# Altium schematic sheet Core CNC shield.SchDoc
size A2; PageSetup: Record=PageOptions|CenterHorizontal=True|CenterVertical=True|PrintScale=0.71|XCorrection=1.00|YCorrection=1.00|PrintKind=1|BorderSize=5000000|LeftOffset=0|BottomOffset=0|Orientation=2|PaperLength=1000|PaperWidth=1000|Scale=100|PaperSource=7|PrintQuality=-4|MediaType=1|DitherType=10|PaperKind=A3 (297 x 420 mm)|PrintScaleMode=1
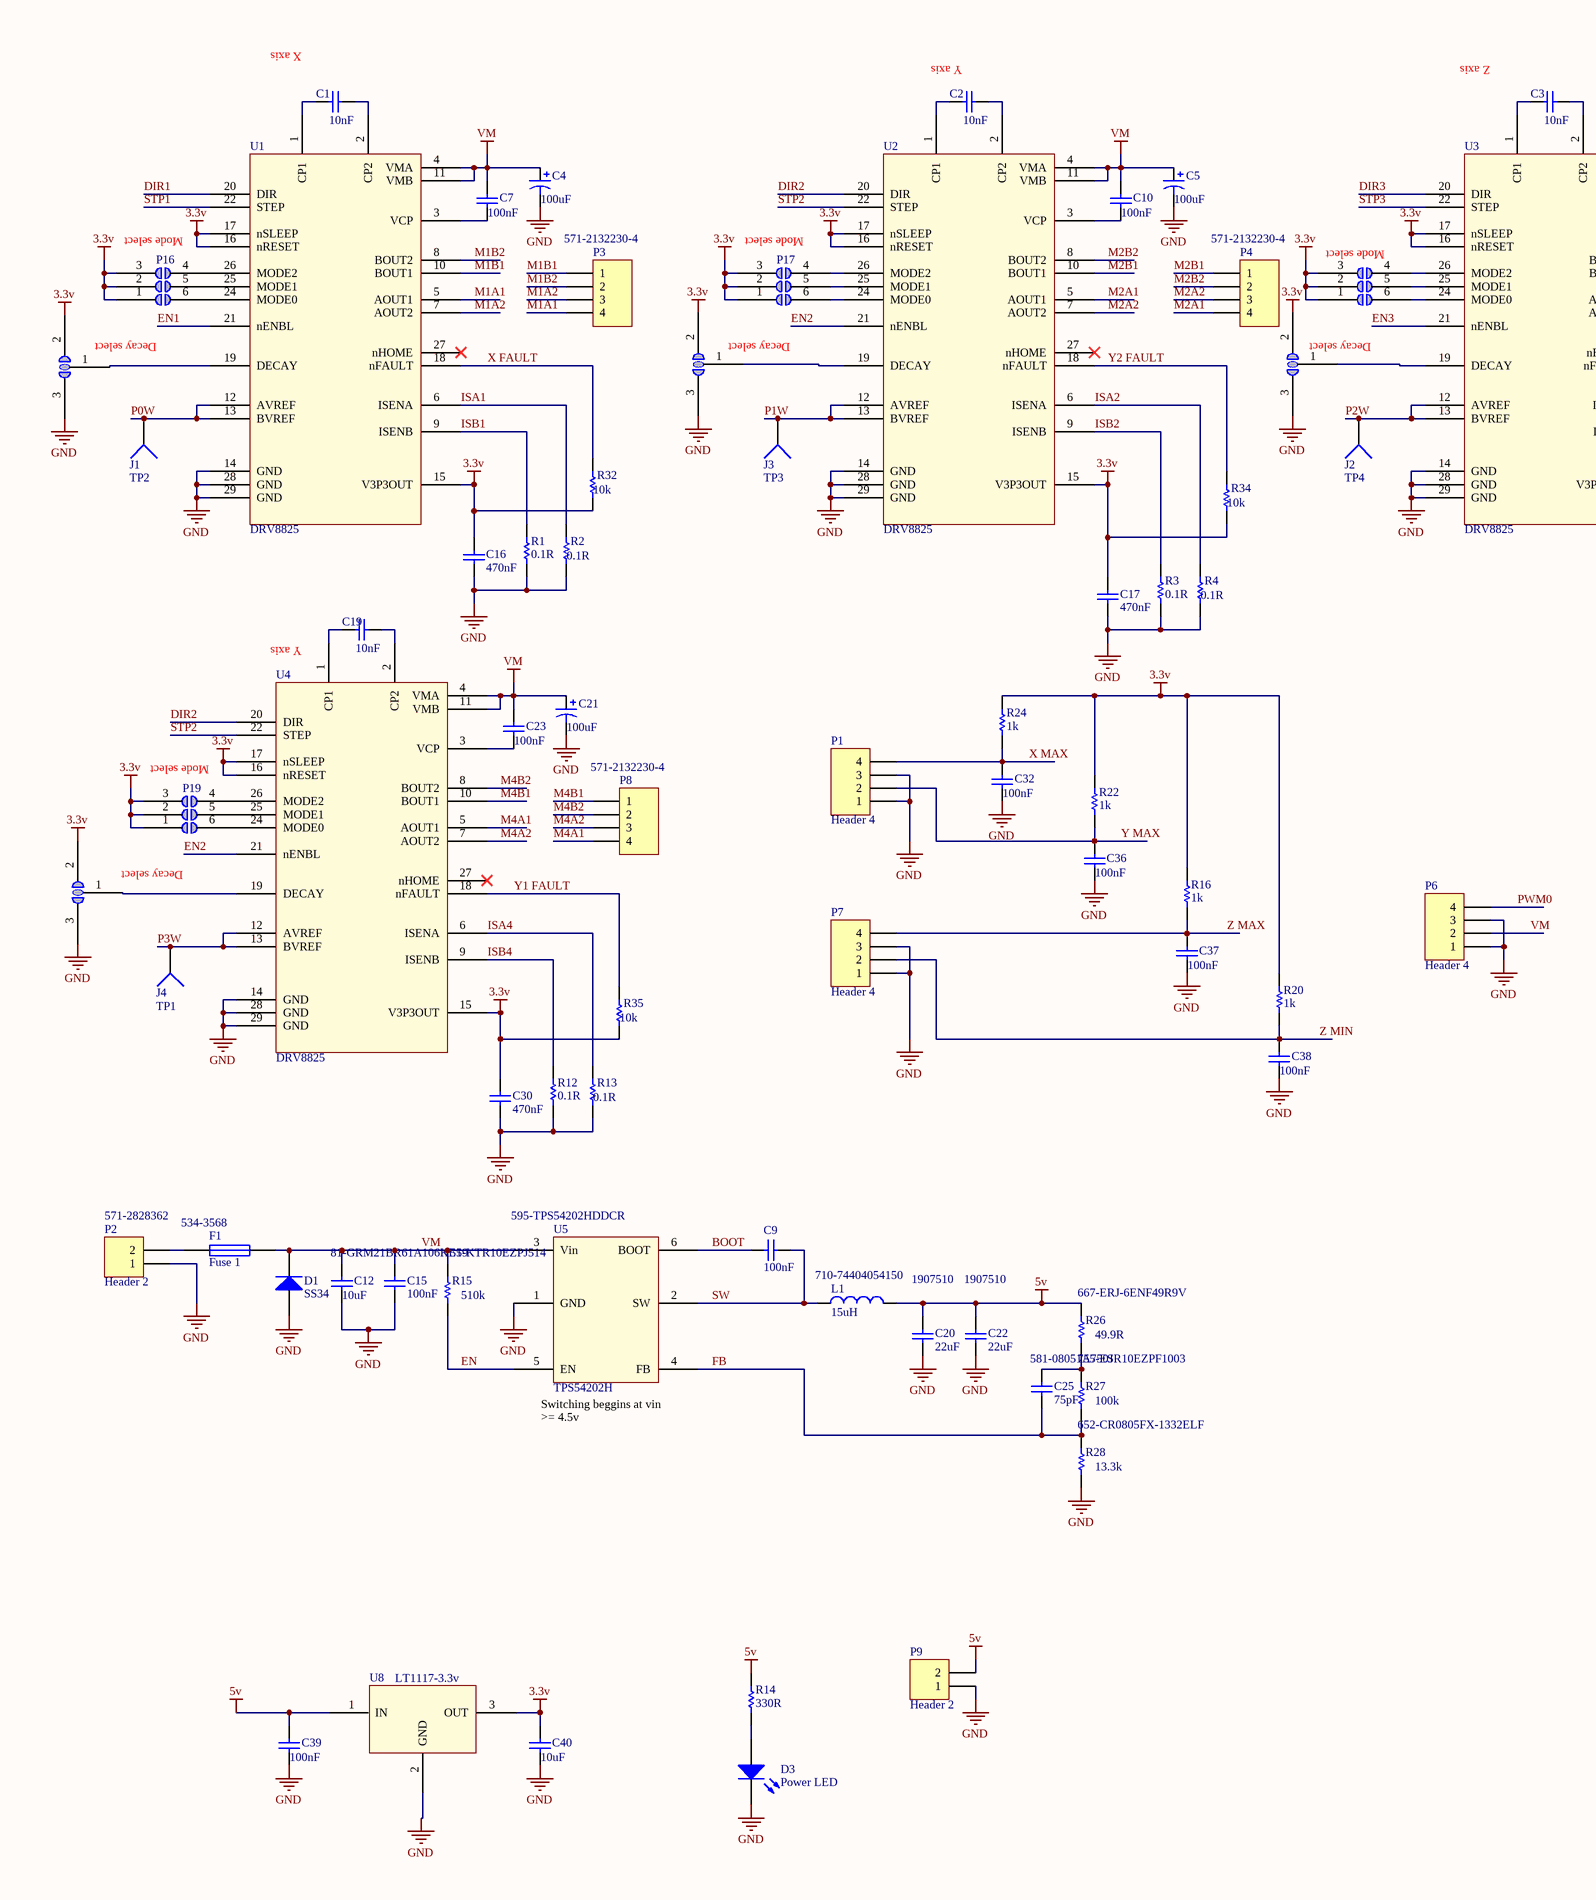
[diagram p0: Core CNC shield.SchDoc, left]
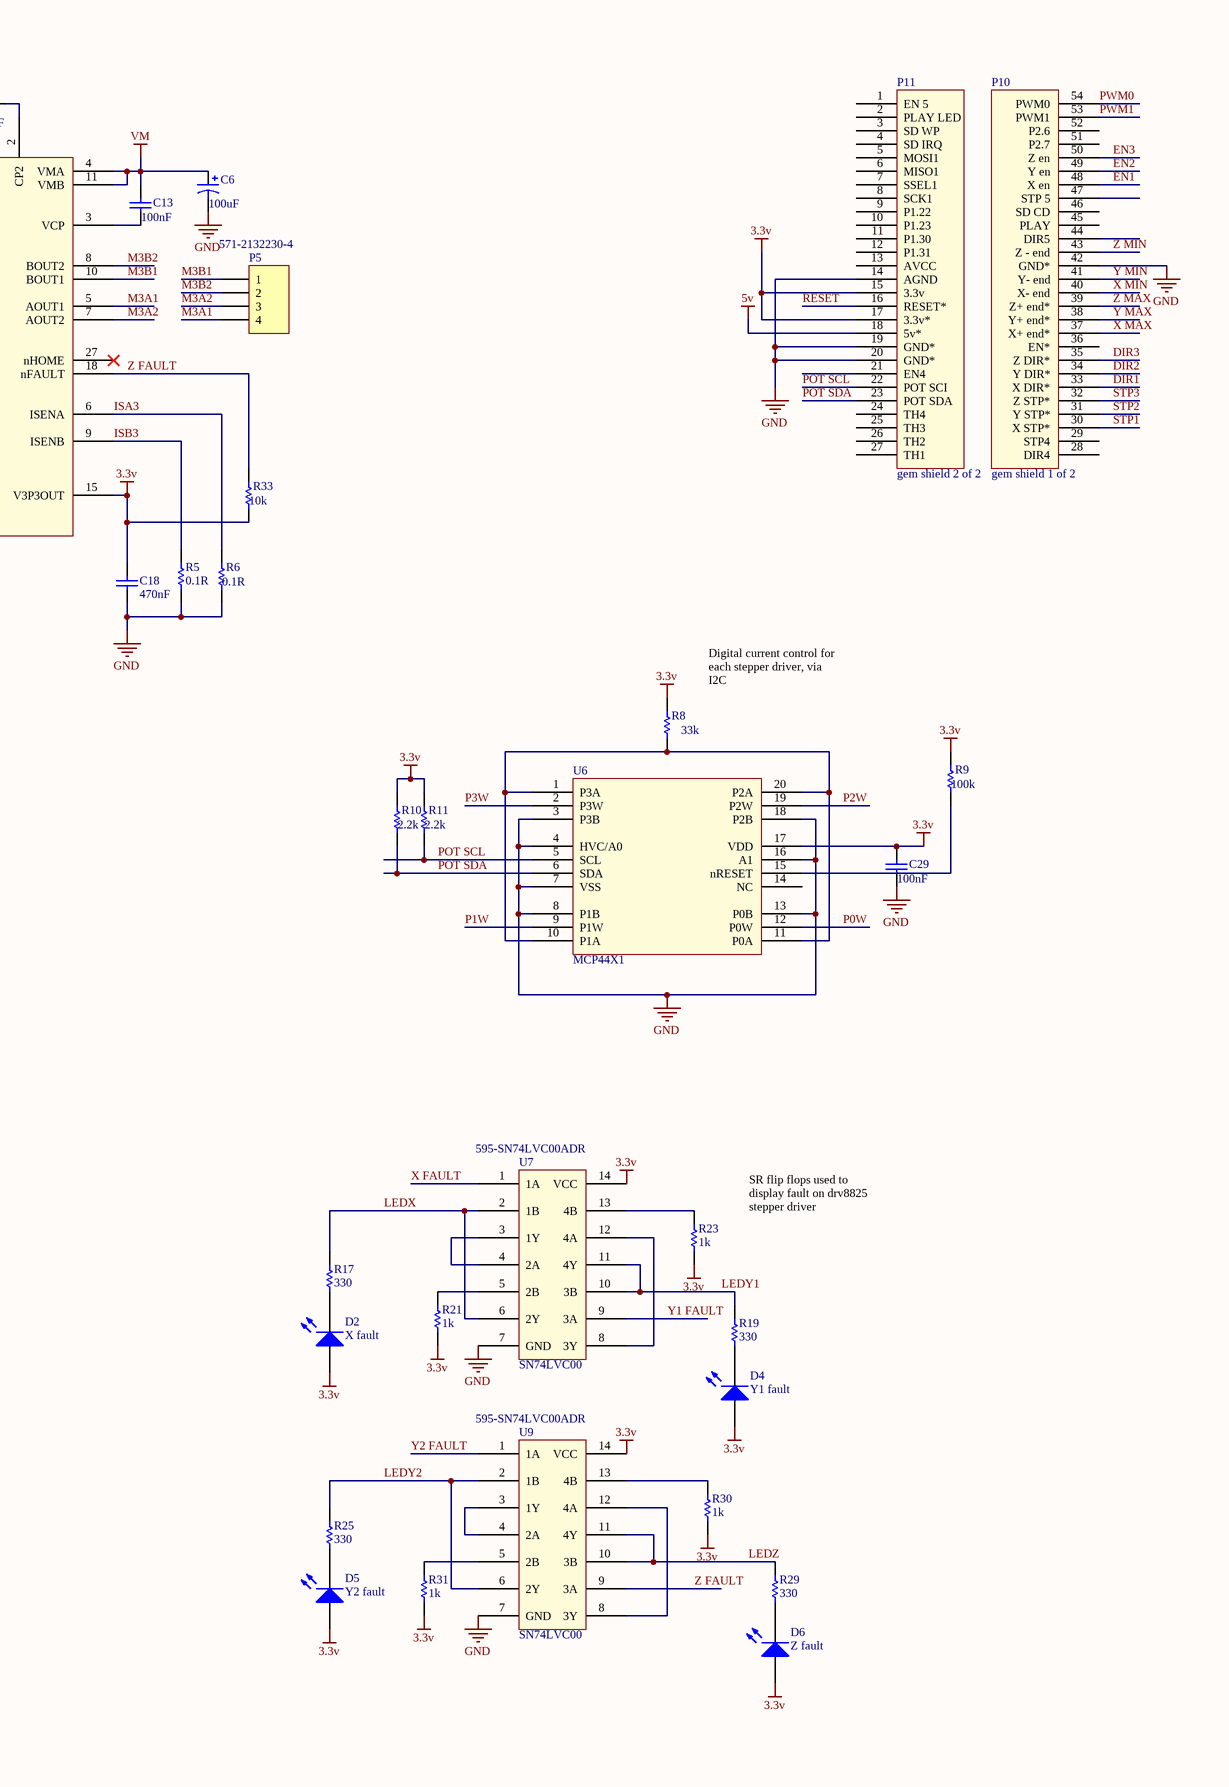
[diagram p1: Core CNC shield.SchDoc, right]

## Parts
C1  10nF  [0805]
C2  10nF  [0805]
C3  10nF  [0805]
C4  100uF  [470uf/ 100uf 50v smd]
C5  100uF  [470uf/ 100uf 50v smd]
C6  100uF  [470uf/ 100uf 50v smd]
C7  100nF  [0805]
C9  100nF  [0805]
C10  100nF  [0805]
C12  Supplier Part Number 1: 81-GRM21BR61A106KE19  [0805]  (hidden comment: 10uF)
C13  100nF  [0805]
C15  100nF  [0805]
C16  470nF  [0805]
C17  470nF  [0805]
C18  470nF  [0805]
C19  10nF  [0805]
C20  Supplier Part Number 4: 1907510  [0805]  (hidden comment: 22uF)
C21  100uF  [470uf/ 100uf 50v smd]
C22  Supplier Part Number 4: 1907510  [0805]  (hidden comment: 22uF)
C23  100nF  [0805]
C25  Supplier Part Number 1: 581-08051A750J  [0805]  (hidden comment: 75pF)
C29  100nF  [0805]
C30  470nF  [0805]
C32  100nF  [0805]
C36  100nF  [0805]
C37  100nF  [0805]
C38  100nF  [0805]
C39  100nF  [0805]
C40  10uF  [0805]
D1  SS34  [Diode]
D2  X fault  [0805 LED]
D3  Power LED  [0805 LED]
D4  Y1 fault  [0805 LED]
D5  Y2 fault  [0805 LED]
D6  Z fault  [0805 LED]
F1  Fuse 1  Supplier Part Number 1: 534-3568  [mini auto fuse]
J1  TP2  [test point]
J2  TP4  [test point]
J3  TP3  [test point]
J4  TP1  [test point]
L1  Supplier Part Number 1: 710-74404054150  [SRN4018 inductor]  (hidden comment: 15uh)
P1  Header 4  [4 way screw]
P2  Header 2  Supplier Part Number 1: 571-2828362  [2 pin screw con]
P3  Supplier Part Number 1: 571-2132230-4  [4 pin screw]  (hidden comment: Header 4)
P4  Supplier Part Number 1: 571-2132230-4  [4 pin screw]  (hidden comment: Header 4)
P5  Supplier Part Number 1: 571-2132230-4  [4 pin screw]  (hidden comment: Header 4)
P6  Header 4  [4 way screw]
P7  Header 4  [4 way screw]
P8  Supplier Part Number 1: 571-2132230-4  [4 pin screw]  (hidden comment: Header 4)
P9  Header 2  [HDR1X2]
P10  gem shield 1 of 2  [gem shield 1 of 2]
P11  gem shield 2 of 2  [gem shield 2 of 2]
P14  (no value)  [2 way jumper]
P15  (no value)  [2 way jumper]
P16  (no value)  [3 way jumper]
P17  (no value)  [3 way jumper]
P18  (no value)  [3 way jumper]
P19  (no value)  [3 way jumper]
P20  (no value)  [2 way jumper]
P21  (no value)  [2 way jumper]
R1  0.1R  [0805]
R2  0.1R  [0805]
R3  0.1R  [0805]
R4  0.1R  [0805]
R5  0.1R  [0805]
R6  0.1R  [0805]
R8  33k  [0805]
R9  100k  [0805]
R10  2.2k  [0805]
R11  2.2k  [0805]
R12  0.1R  [0805]
R13  0.1R  [0805]
R14  330R  [0805]
R15  Supplier Part Number 1: 755-KTR10EZPJ514  [0805]  (hidden comment: 510k)
R16  1k  [0805]
R17  value 330  [0805]  (hidden comment: 330R)
R19  value 330  [0805]  (hidden comment: 330R)
R20  1k  [0805]
R21  1k  [0805]
R22  1k  [0805]
R23  1k  [0805]
R24  1k  [0805]
R25  value 330  [0805]  (hidden comment: 330R)
R26  Supplier Part Number 1: 667-ERJ-6ENF49R9V  [0805]  (hidden comment: 49.9R)
R27  Supplier Part Number 1: 755-ESR10EZPF1003  [0805]  (hidden comment: 100k)
R28  Supplier Part Number 1: 652-CR0805FX-1332ELF  [0805]  (hidden comment: 13.3k)
R29  value 330  [0805]  (hidden comment: 330R)
R30  1k  [0805]
R31  1k  [0805]
R32  value 10k  [0805]  (hidden comment: 0.1R)
R33  value 10k  [0805]  (hidden comment: 0.1R)
R34  value 10k  [0805]  (hidden comment: 0.1R)
R35  value 10k  [0805]  (hidden comment: 0.1R)
U1  DRV8825  [DRV8825 ic]
U2  DRV8825  [DRV8825 ic]
U3  DRV8825  [DRV8825 ic]
U4  DRV8825  [DRV8825 ic]
U5  TPS54202H  Supplier Part Number 1: 595-TPS54202HDDCR  [TPS54202H]
U6  MCP44X1  [MCP44X1]
U7  SN74LVC00  Supplier Part Number 1: 595-SN74LVC00ADR  [sn74lv00]
U8  LT1117-3.3v  [SOT223]
U9  SN74LVC00  Supplier Part Number 1: 595-SN74LVC00ADR  [sn74lv00]

## Nets
3.3v: C16.2 C17.2 C18.2 C29.2 C30.2 C40.2 D2.1(A) D4.1(A) D5.1(A) D6.1(A) P11.15(3.3v) P11.17(3.3v*) P14.2 P15.2 P16.1 P16.2 P16.3 P17.1 P17.2 P17.3 P18.1 P18.2 P18.3 P19.1 P19.2 P19.3 P20.2 P21.2 R8.2 R9.2 R10.2 R11.2 R16.1 R20.1 R21.2 R22.1 R23.2 R24.1 R30.2 R31.2 R32.1 R33.1 R34.1 R35.1 U1.15(V3P3OUT) U1.16(nRESET) U1.17(nSLEEP) U2.15(V3P3OUT) U2.16(nRESET) U2.17(nSLEEP) U3.15(V3P3OUT) U3.16(nRESET) U3.17(nSLEEP) U4.15(V3P3OUT) U4.16(nRESET) U4.17(nSLEEP) U6.17(VDD) U7.14(VCC) U8.3(OUT) U9.14(VCC)
5v: C20.1 C22.1 C39.2 L1.2 P9.2 P11.18(5v*) R14.1 R26.2 U8.1(IN)
GND: C4.2 C5.2 C6.2 C12.1 C15.2 C16.1 C17.1 C18.1 C20.2 C21.2 C22.2 C29.1 C30.1 C32.1 C36.1 C37.1 C38.1 C39.1 C40.1 D1.1(A) D3.2(K) P1.1 P1.3 P2.1 P6.1 P6.3 P7.1 P7.3 P9.1 P10.42(GND*) P11.14(AGND) P11.19(GND*) P11.20(GND*) P14.3 P15.3 P20.3 P21.3 R1.2 R2.1 R3.2 R4.1 R5.2 R6.1 R12.2 R13.1 R28.1 U1.14(GND) U1.28(GND) U1.29(GND) U2.14(GND) U2.28(GND) U2.29(GND) U3.14(GND) U3.28(GND) U3.29(GND) U4.14(GND) U4.28(GND) U4.29(GND) U5.1(GND) U6.3(P3B) U6.4(HVC/A0) U6.7(VSS) U6.8(P1B) U6.13(P0B) U6.16(A1) U6.18(P2B) U7.7(GND) U8.2(GND) U9.7(GND)
VM: C4.1 C5.1 C6.1 C7.2 C10.2 C12.2 C13.2 C15.1 C21.1 C23.2 D1.2(K) F1.2 P6.2 R15.2 U1.4(VMA) U1.11(VMB) U2.4(VMA) U2.11(VMB) U3.4(VMA) U3.11(VMB) U4.4(VMA) U4.11(VMB) U5.3(Vin)
BOOT: C9.2 U5.6(BOOT)
DIR1: P10.33(X_DIR*) U1.20(DIR)
DIR2: P10.34(Y_DIR*) U2.20(DIR) U4.20(DIR)
DIR3: P10.35(Z_DIR*) U3.20(DIR)
EN: R15.1 U5.5(EN)
EN1: P10.48(X_en) U1.21(nENBL)
EN2: P10.49(Y_en) U2.21(nENBL) U4.21(nENBL)
EN3: P10.50(Z_en) U3.21(nENBL)
FB: C25.2 R27.1 R28.2 U5.4(FB)
ISA1: R2.2 U1.6(ISENA)
ISA2: R4.2 U2.6(ISENA)
ISA3: R6.2 U3.6(ISENA)
ISA4: R13.2 U4.6(ISENA)
ISB1: R1.1 U1.9(ISENB)
ISB2: R3.1 U2.9(ISENB)
ISB3: R5.1 U3.9(ISENB)
ISB4: R12.1 U4.9(ISENB)
LEDX: R17.1 U7.2(1B) U7.6(2Y)
LEDY1: R19.1 U7.10(3B) U7.11(4Y)
LEDY2: R25.1 U9.2(1B) U9.6(2Y)
LEDZ: R29.1 U9.10(3B) U9.11(4Y)
M1A1: P3.4 U1.5(AOUT1)
M1A2: P3.3 U1.7(AOUT2)
M1B1: P3.1 U1.10(BOUT1)
M1B2: P3.2 U1.8(BOUT2)
M2A1: P4.4 U2.5(AOUT1)
M2A2: P4.3 U2.7(AOUT2)
M2B1: P4.1 U2.10(BOUT1)
M2B2: P4.2 U2.8(BOUT2)
M3A1: P5.4 U3.5(AOUT1)
M3A2: P5.3 U3.7(AOUT2)
M3B1: P5.1 U3.10(BOUT1)
M3B2: P5.2 U3.8(BOUT2)
M4A1: P8.4 U4.5(AOUT1)
M4A2: P8.3 U4.7(AOUT2)
M4B1: P8.1 U4.10(BOUT1)
M4B2: P8.2 U4.8(BOUT2)
P0W: J1.1 U1.12(AVREF) U1.13(BVREF) U6.12(P0W)
P1W: J3.1 U2.12(AVREF) U2.13(BVREF) U6.9(P1W)
P2W: J2.1 U3.12(AVREF) U3.13(BVREF) U6.19(P2W)
P3W: J4.1 U4.12(AVREF) U4.13(BVREF) U6.2(P3W)
POT SCL: P11.22(POT_SCI) R11.1 U6.5(SCL)
POT SDA: P11.23(POT_SDA) R10.1 U6.6(SDA)
PWM0: P6.4 P10.54(PWM0)
PWM1: P10.53(PWM1)
RESET: P11.16(RESET*)
STP1: P10.30(X_STP*) U1.22(STEP)
STP2: P10.31(Y_STP*) U2.22(STEP) U4.22(STEP)
STP3: P10.32(Z_STP*) U3.22(STEP)
SW: C9.1 L1.1 U5.2(SW)
X FAULT: R32.2 U1.18(nFAULT) U7.1(1A)
X MAX: C32.2 P1.4 P10.37(X+_end*) R24.2
X MIN: P10.40(X-_end)
Y1 FAULT: R35.2 U4.18(nFAULT) U7.9(3A)
Y2 FAULT: R34.2 U2.18(nFAULT) U9.1(1A)
Y MAX: C36.2 P1.2 P10.38(Y+_end*) R22.2
Y MIN: P10.41(Y-_end)
Z FAULT: R33.2 U3.18(nFAULT) U9.9(3A)
Z MAX: C37.2 P7.4 P10.39(Z+_end*) R16.2
Z MIN: C38.2 P7.2 P10.43(Z_-_end) R20.2
NetC1_1: C1.1 U1.2(CP2)
NetC1_2: C1.2 U1.1(CP1)
NetC2_1: C2.1 U2.2(CP2)
NetC2_2: C2.2 U2.1(CP1)
NetC3_1: C3.1 U3.2(CP2)
NetC3_2: C3.2 U3.1(CP1)
NetC7_1: C7.1 U1.3(VCP)
NetC10_1: C10.1 U2.3(VCP)
NetC13_1: C13.1 U3.3(VCP)
NetC19_1: C19.1 U4.2(CP2)
NetC19_2: C19.2 U4.1(CP1)
NetC23_1: C23.1 U4.3(VCP)
NetC25_1: C25.1 R26.1 R27.2
NetD2_2: D2.2(K) R17.2
NetD3_1: D3.1(A) R14.2
NetD4_2: D4.2(K) R19.2
NetD5_2: D5.2(K) R25.2
NetD6_2: D6.2(K) R29.2
NetF1_1: F1.1 P2.2
NetP14_1: P14.1 U1.19(DECAY)
NetP15_1: P15.1 U2.19(DECAY)
NetP16_4: P16.4 U1.26(MODE2)
NetP16_5: P16.5 U1.25(MODE1)
NetP16_6: P16.6 U1.24(MODE0)
NetP17_4: P17.4 U2.26(MODE2)
NetP17_5: P17.5 U2.25(MODE1)
NetP17_6: P17.6 U2.24(MODE0)
NetP18_4: P18.4 U3.26(MODE2)
NetP18_5: P18.5 U3.25(MODE1)
NetP18_6: P18.6 U3.24(MODE0)
NetP19_4: P19.4 U4.26(MODE2)
NetP19_5: P19.5 U4.25(MODE1)
NetP19_6: P19.6 U4.24(MODE0)
NetP20_1: P20.1 U3.19(DECAY)
NetP21_1: P21.1 U4.19(DECAY)
NetR8_1: R8.1 U6.1(P3A) U6.10(P1A) U6.11(P0A) U6.20(P2A)
NetR9_1: R9.1 U6.15(nRESET)
NetR21_1: R21.1 U7.5(2B)
NetR23_1: R23.1 U7.13(4B)
NetR30_1: R30.1 U9.13(4B)
NetR31_1: R31.1 U9.5(2B)
NetU7_3: U7.3(1Y) U7.4(2A)
NetU7_8: U7.8(3Y) U7.12(4A)
NetU9_3: U9.3(1Y) U9.4(2A)
NetU9_8: U9.8(3Y) U9.12(4A)

Not connected (* = marked no-connect by the designer): P10 28(DIR4) 29(STP4) 36(EN*) 44(DIR5) 45(PLAY) 46(SD_CD) 47(STP_5) 51(P2.7) 52(P2.6); P11 1(EN_5) 2(PLAY_LED) 3(SD_WP) 4(SD_IRQ) 5(MOSI1) 6(MISO1) 7(SSEL1) 8(SCK1) 9(P1.22) 10(P1.23) 11(P1.30) 12(P1.31) 13(AVCC) 21(EN4) 24(TH4) 25(TH3) 26(TH2) 27(TH1); U1 27(nHOME)*; U2 27(nHOME)*; U3 27(nHOME)*; U4 27(nHOME)*; U6 14(NC)

## Notes on the sheet
- (near C1) X axis
- (near C2) Y axis
- Z axis
- (near P16) Mode select
- (near P17) Mode select
- (near P18) Mode select
- (near P14) Decay select
- (near P15) Decay select
- (near P20) Decay select
- (near U4) Y axis
- (near R8) Digital current control for each stepper driver, via I2C
- (near P19) Mode select
- Decay select
- SR flip flops used to display fault on drv8825 stepper driver
- (near U5) Switching beggins at vin >= 4.5v

## Library data of the parts
C1-C3 C7 C9 C10 C12 C13 C15-C20 C22 C23 C25 C29 C30 C32 C36-C40 = Cap: Capacitor; Published: 8-Jun-2000; LatestRevisionDate: 17-Jul-2002; LatestRevisionNote: Re-released for DXP Platform.; PackageReference: RAD-0.3; Publisher: Altium Limited; PackageDescription: Radial Cap, Thru-Hole; 2 Leads; 0.3 in Pin Spacing
  C1 C2 C19: Value: 10nF
  C3: Value: 10nF; Supplier 1: Mouser; Supplier Part Number 1: 81-GRM40X103K50D
  C7 C9 C10 C13 C15 C23 C29 C32 C36-C39: Value: 100nF
  C12: Value: 10uF; Supplier 1: Mouser
  C16-C18 C30: Value: 470nF; Supplier 1: Mouser; Supplier Part Number 1: 80-C0805C474K4R
  C20 C22: Value: 22uF; Supplier 1: Mouser; Supplier 2: Mouser; Supplier 3: Mouser; Supplier 4: Farnell
  C25: Value: 75pF; Supplier 1: Mouser
  C40: Value: 10uF
C4-C6 C21 = Cap Pol1: Polarized Capacitor (Radial); Published: 8-Jun-2000; LatestRevisionDate: 17-Jul-2002; LatestRevisionNote: Re-released for DXP Platform.; PackageReference: RB7.6-15; Publisher: Altium Limited; PackageDescription: Polarized Capacitor (Radial); 2 Leads; Value: 100uF
D1 = Diode: Default Diode; Published: 8-Jun-2000; LatestRevisionDate: 17-Jul-2002; LatestRevisionNote: Re-released for DXP Platform.; PackageVersion: Sep-1996; PackageReference: SMC; Publisher: Altium Limited; PackageDescription: DO-214-AB/SMC; 2 C-Bend Leads; Body 7.9 x 5.9 mm, inc. leads (LxW); Code_JEDEC: DO-214-AB
D2-D6 = LED2: Typical RED, GREEN, YELLOW, AMBER GaAs LED; Published: 8-Jun-2000; LatestRevisionDate: 17-Jul-2002; LatestRevisionNote: Re-released for DXP Platform.; PackageVersion: Feb-2002; PackageReference: 3.2X1.6X1.1; Publisher: Altium Limited; PackageDescription: SM LED; 2 Flat Leads
F1 = Fuse 1: Fuse; Published: 8-Jun-2000; LatestRevisionDate: 17-Jul-2002; LatestRevisionNote: Re-released for DXP Platform.; PackageReference: PIN-W2/E2.8; Publisher: Altium Limited; PackageDescription: Thru-Hole; 2 Leads; Supplier 1: Mouser
J1-J4 = Socket: LatestRevisionDate: 17-Jul-2002; LatestRevisionNote: Re-released for DXP Platform.; Publisher: Altium Limited
L1 = Inductor: Code_IEC: 1005; Published: 8-Jun-2000; LatestRevisionDate: 29-May-2009; LatestRevisionNote: IPC-7351 Footprint Added.; PackageReference: 0402-A; Publisher: Altium Limited; PackageDescription: Chip Inductor; Code_JEITA: 0402; Value: 15uH; Supplier 2: Mouser; Supplier Part Number 2: 652-SRN4018-101M; Supplier 1: Mouser
P1 P3-P8 = Header 4: Header, 4-Pin; LatestRevisionDate: 17-Jul-2002; LatestRevisionNote: Re-released for DXP Platform.; Publisher: Altium Limited
  P3-P5 P8: Supplier 1: Mouser
P2 P9 = Header 2: Header, 2-Pin; LatestRevisionDate: 17-Jul-2002; LatestRevisionNote: Re-released for DXP Platform.; Publisher: Altium Limited
  P2: Supplier 1: Mouser
P14 P15 P20 P21 = voltage selector
P16-P19 = 3 way jumper
R1-R6 R8-R17 R19-R35 = Res1: Resistor; Published: 8-Jun-2000; LatestRevisionDate: 17-Jul-2002; LatestRevisionNote: Re-released for DXP Platform.; PackageReference: AXIAL-0.3; Publisher: Altium Limited; PackageDescription: Axial Device, Thru-Hole; 2 Leads; 0.3 in Pin Spacing
  R1-R6 R13: Value: 0.1R
  R8: Value: 33k; Supplier 1: Mouser; Supplier Part Number 1: 652-CR0805JW-333ELF
  R9: Value: 100k; Supplier 1: Mouser; Supplier Part Number 1: 667-ERJ-6ENF1003V
  R10: Value: 2.2k
  R11: Value: 2.2k; Supplier 1: Mouser; Supplier Part Number 1: 667-ERJ-6ENF2201V
  R12: Value: 0.1R; Supplier 1: Mouser; Supplier Part Number 1: 754-RL1220S-R10-F
  R14: Value: 330R; Supplier 1: Mouser; Supplier Part Number 1: 81-BLM21P331SG
  R15: Value: 510k; Supplier 1: Mouser
  R16: Value: 1k; Supplier 1: Mouser; Supplier Part Number 1: 71-CRCW0805-1.0K-E3
  R20-R24 R30 R31: Value: 1k
  R26: Value: 49.9R; Supplier 1: Mouser
  R27: Value: 100k; Supplier 1: Mouser
  R28: Value: 13.3k; Supplier 1: Mouser
U1-U4 = DRV8825 ic
  U3: Supplier 1: Mouser; Supplier Part Number 1: 595-DRV8825PWPR
U5 = TPS5420H: Supplier 1: Mouser
U6 = MCP44X1: Supplier 1: Mouser; Supplier Part Number 1: 579-MCP4451-103E/ST
U7 U9 = SN74LVC00: Supplier 1: Mouser